# EAGLE design MI0283QT_v12 (EAGLE 6.6.0)
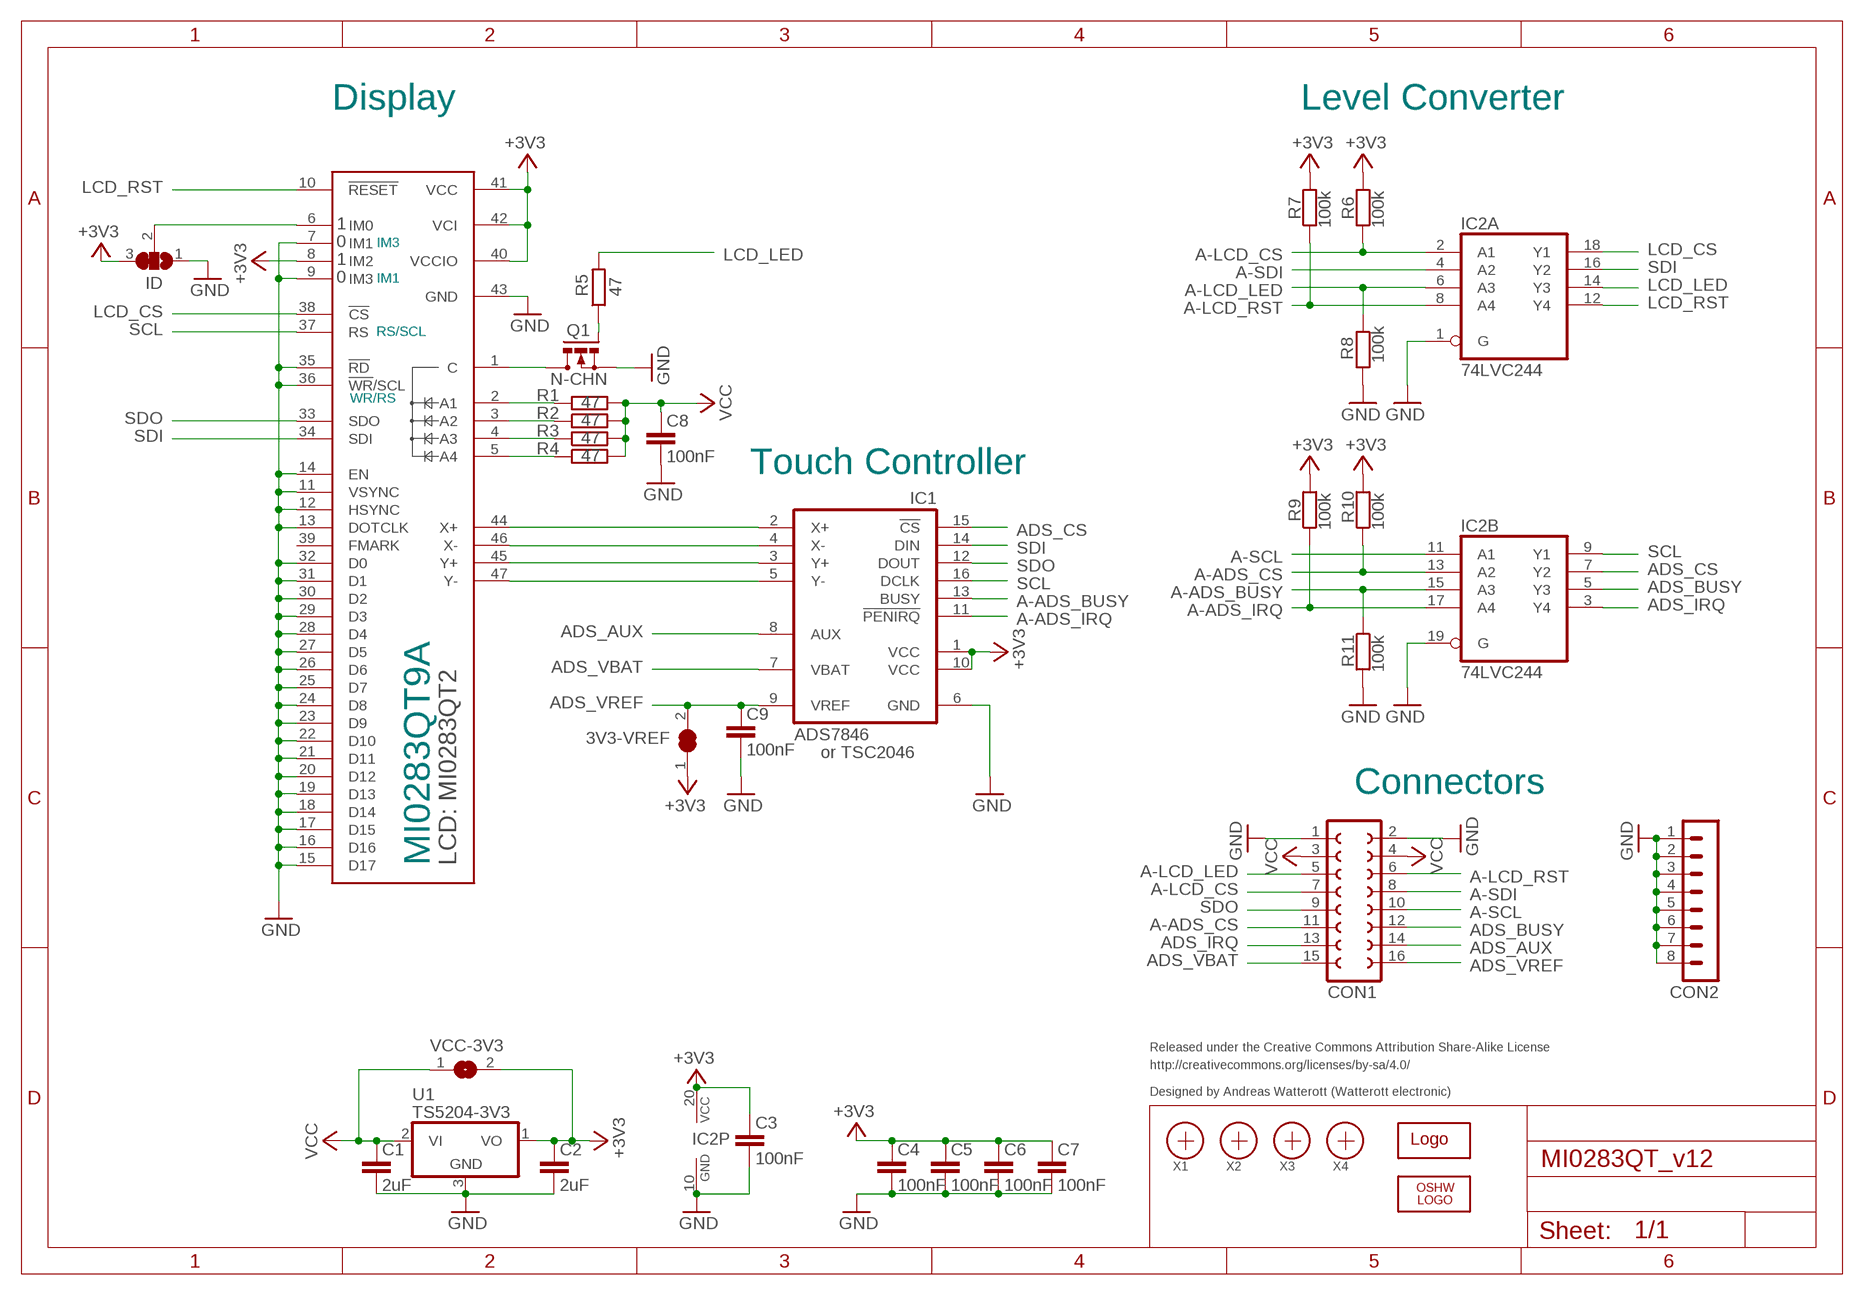
[diagram p0: schematic, sheet 1]

## Parts
3V3-VREF  SJ  [SJ]
C1  2uF  C-EUC0805  [C0805]
C2  2uF  C-EUC0805  [C0805]
C3  100nF  C-EUC0603  [C0603]
C4  100nF  C-EUC0603  [C0603]
C5  100nF  C-EUC0603  [C0603]
C6  100nF  C-EUC0603  [C0603]
C7  100nF  C-EUC0603  [C0603]
C8  100nF  C-EUC0603  [C0603]
C9  100nF  C-EUC0603  [C0603]
CON1  FE08-2  [FE08-2]
CON2  MA08-1  [MA08-1]
IC1  ADS7846  [SSOP16]
IC2  74LVC244  74HC244DW  [SO20W]
ID  SJ2W  [SJ_2]
LCD  MI0283QT  [MI0283QT]
LOGO1  OSHW_LOGO_6MILX0150-NT  [OSHW_6X150_NOTEXT]
Q1  N-CHN  IRLML2502  [MICRO3]
R1  47  R-EU_R0603  [R0603]
R2  47  R-EU_R0603  [R0603]
R3  47  R-EU_R0603  [R0603]
R4  47  R-EU_R0603  [R0603]
R5  47  R-EU_R0603  [R0603]
R6  100k  R-EU_R0603  [R0603]
R7  100k  R-EU_R0603  [R0603]
R8  100k  R-EU_R0603  [R0603]
R9  100k  R-EU_R0603  [R0603]
R10  100k  R-EU_R0603  [R0603]
R11  100k  R-EU_R0603  [R0603]
U1  TS5204-3V3  TS5204  [SOT23]
U$1  WE-LOGO  [WE-LOGO]
VCC-3V3  SJ  [SJ]
X1  PASSER  [PASSER]
X2  PASSER  [PASSER]
X3  PASSER  [PASSER]
X4  PASSER  [PASSER]

## Nets
+3V3: 3V3-VREF.1 C2.1 C3.1 C4.1 C5.1 C6.1 C7.1 IC1.1(VCC) IC1.10(VCC) IC2.20(P:VCC) ID.3 LCD.8(IM2) LCD.40(VCCIO) LCD.41(VCC) LCD.42(VCI) R6.2 R7.2 R9.2 R10.2 U1.1(VO) VCC-3V3.2
A-ADS_BUSY: IC1.13(BUSY) IC2.15(B:A3) R11.1
A-ADS_CS: CON1.11 IC2.13(B:A2) R10.1
A-ADS_IRQ: IC1.11(!PENIRQ) IC2.17(B:A4) R9.1
A-LCD_CS: CON1.7 IC2.2(A:A1) R6.1
A-LCD_LED: CON1.5 IC2.6(A:A3) R8.1
A-LCD_RST: CON1.6 IC2.8(A:A4) R7.1
A-SCL: CON1.10 IC2.11(B:A1)
A-SDI: CON1.8 IC2.4(A:A2)
ADS_AUX: CON1.14 IC1.8(AUX)
ADS_BUSY: CON1.12 IC2.5(B:Y3)
ADS_CS: IC1.15(!CS) IC2.7(B:Y2)
ADS_IRQ: CON1.13 IC2.3(B:Y4)
ADS_VBAT: CON1.15 IC1.7(VBAT)
ADS_VREF: 3V3-VREF.2 C9.1 CON1.16 IC1.9(VREF)
C: LCD.1(C) Q1.3(D)
GND: C1.2 C2.2 C3.2 C4.2 C5.2 C6.2 C7.2 C8.2 C9.2 CON1.1 CON1.2 CON2.1 CON2.2 CON2.3 CON2.4 CON2.5 CON2.6 CON2.7 CON2.8 IC1.6(GND) IC2.1(A:G) IC2.10(P:GND) IC2.19(B:G) ID.1 LCD.7(IM1) LCD.9(IM3) LCD.11(VSYNC) LCD.12(HSYNC) LCD.13(DOTCLK) LCD.14(EN) LCD.15(D17) LCD.16(D16) LCD.17(D15) LCD.18(D14) LCD.19(D13) LCD.20(D12) LCD.21(D11) LCD.22(D10) LCD.23(D9) LCD.24(D8) LCD.25(D7) LCD.26(D6) LCD.27(D5) LCD.28(D4) LCD.29(D3) LCD.30(D2) LCD.31(D1) LCD.32(D0) LCD.35(!RD) LCD.36(!WR!/SCL) LCD.43(GND) Q1.2(S) R8.2 R11.2 U1.3(GND)
IM0: ID.2 LCD.6(IM0)
LCD_CS: IC2.18(A:Y1) LCD.38(!CS)
LCD_LED: IC2.14(A:Y3) R5.2
LCD_RST: IC2.12(A:Y4) LCD.10(!RESET)
LED_A1: LCD.2(A1) R1.1
LED_A2: LCD.3(A2) R2.1
LED_A3: LCD.4(A3) R3.1
LED_A4: LCD.5(A4) R4.1
LEDPWM: Q1.1(G) R5.1
SCL: IC1.16(DCLK) IC2.9(B:Y1) LCD.37(RS)
SDI: IC1.14(DIN) IC2.16(A:Y2) LCD.34(SDI)
SDO: CON1.9 IC1.12(DOUT) LCD.33(SDO)
VCC: C1.1 C8.1 CON1.3 CON1.4 R1.2 R2.2 R3.2 R4.2 U1.2(VI) VCC-3V3.1
X+: IC1.2(X+) LCD.44(X+)
X-: IC1.4(X-) LCD.46(X-)
Y+: IC1.3(Y+) LCD.45(Y+)
Y-: IC1.5(Y-) LCD.47(Y-)
Unconnected: LCD.39(FMARK)

## Notes on the sheet
- Display | Level Converter
- 1
- 0 | IM3
- 1
- 0 | IM1
- RS/SCL
- WR/RS
- Touch Controller
- or TSC2046
- Connectors
- MI0283QT9A
- Released under the Creative Commons Attribution Share-Alike License
- http://creativecommons.org/licenses/by-sa/4.0/
- Designed by Andreas Watterott (Watterott electronic)

## Library data of the parts
3V3-VREF VCC-3V3 = jumper:SJ: SMD solder JUMPER
C1-C9 = rcl:C-EU: CAPACITOR, European symbol
CON1 = con-lsta:FE08-2: FEMALE HEADER
CON2 = con-lstb:MA08-1: PIN HEADER; OC_FARNELL: unknown; OC_NEWARK: unknown
IC1 = Display:ADS7846: ADS7846 Touch Screen Controller
IC2 = 74xx-eu:74*244: Octal BUFFER and LINE DRIVER, 3-state
ID = jumper:SJ2W: SMD solder JUMPER
LCD = Display:MI0283QT: Multi-Inno MIO283QT2 LCD (240x320) with Renesas R61505U controller
LOGO1 = OSHW:OSHW_LOGO_6MIL
Q1 = IRF-sot23:IRLML2502: N-Channel Power MOSFET
R1-R11 = rcl:R-EU_: RESISTOR, European symbol
U1 = Voltage-Reg:TS5204
U$1 = welectronic:WE-LOGO
X1-X4 = SMD:PASSER

## Board
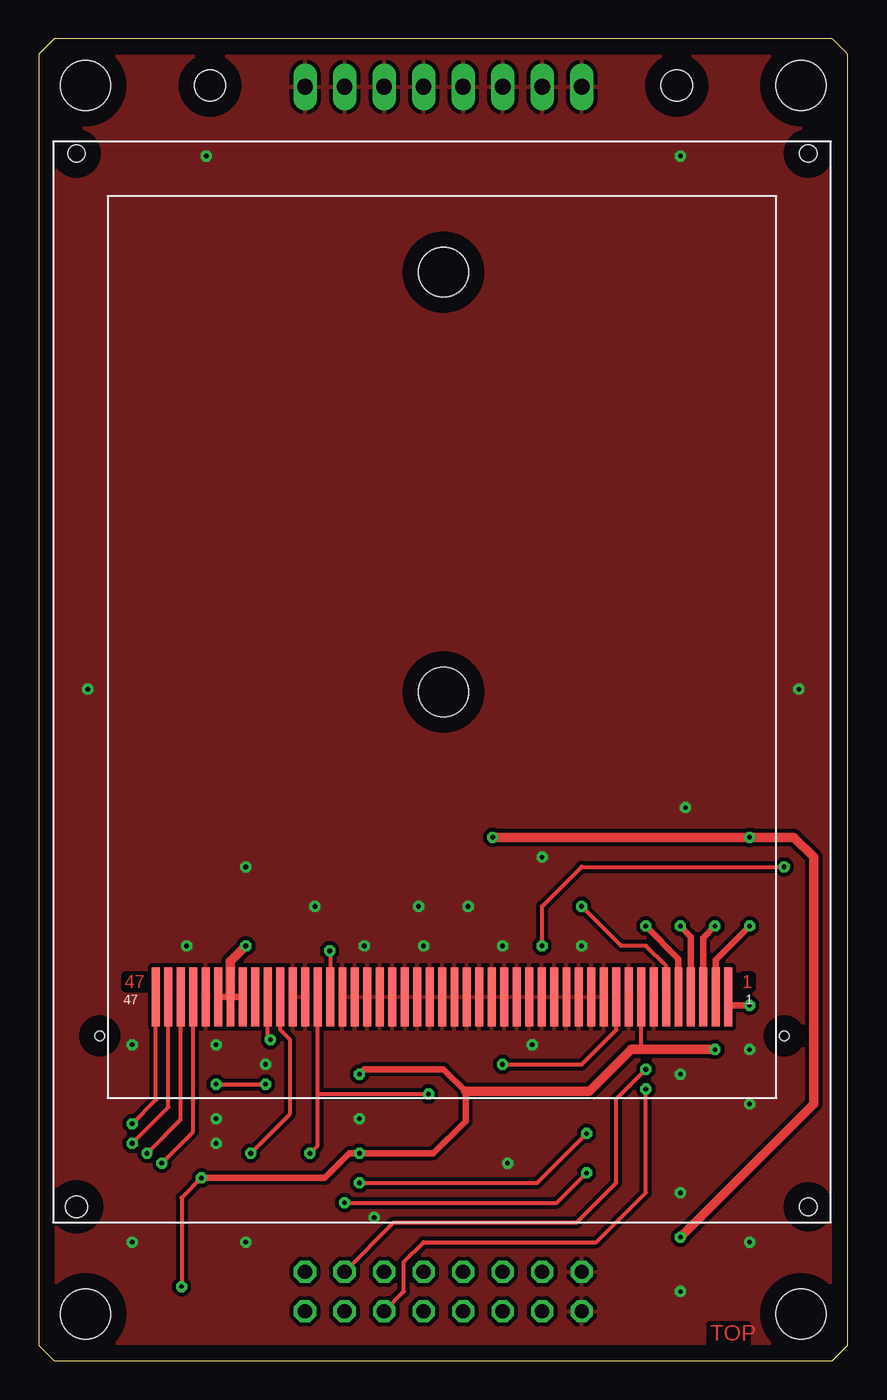
[diagram p1: board, top side]
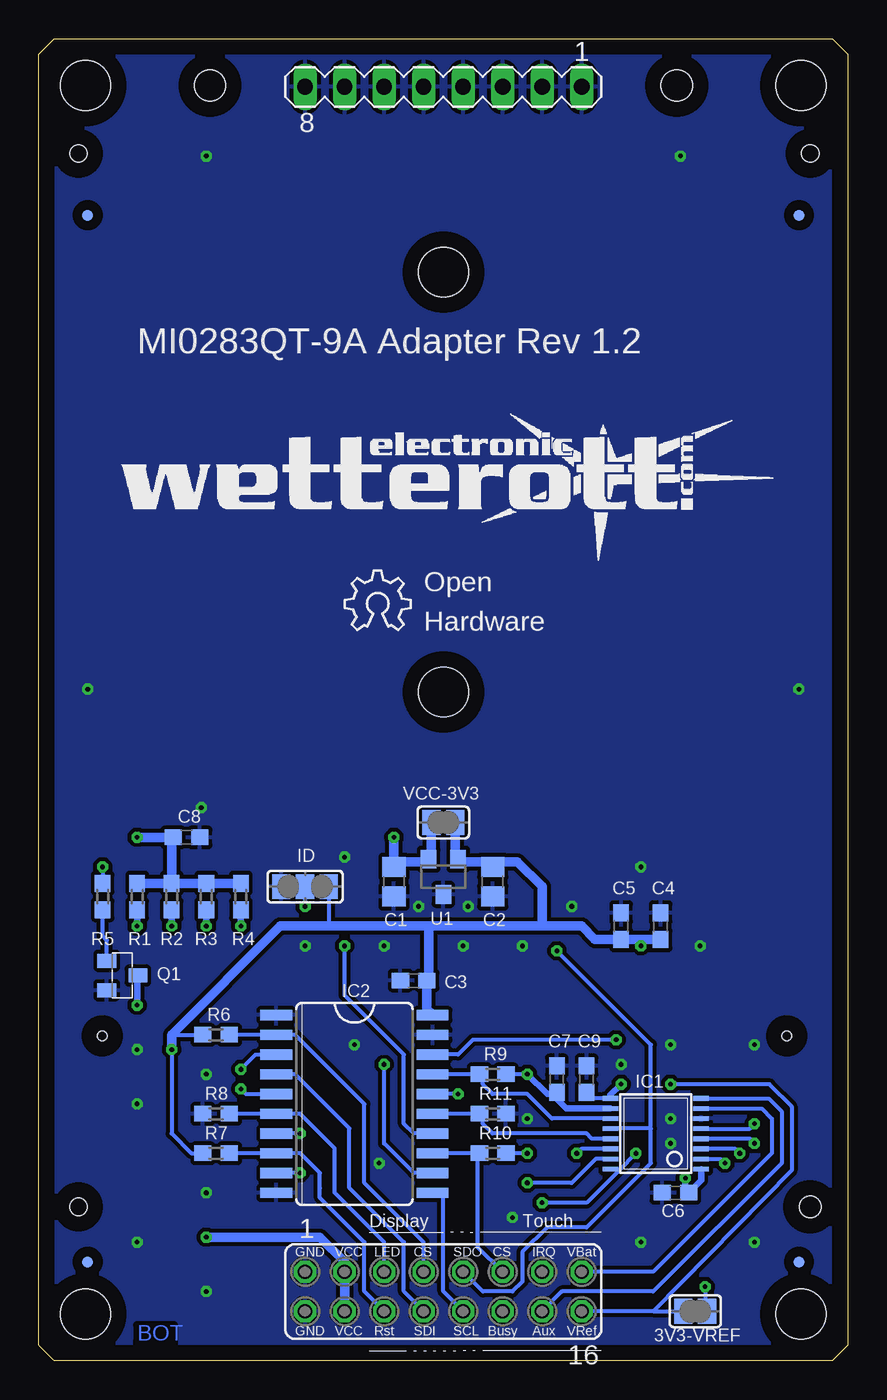
[diagram p2: board, bottom side, seen from below]

Size 52 x 85 mm. Coordinates in mm from the lower left corner, seen from the top.
Outline: 0,1 1,0 51,0 52,1 52,84 51,85 1,85 0,84 0,1
Copper layers (1*16): Top 0.035mm / dielectric 1.5mm / Bottom 0.035mm
Design rules "default *": minimum track width 10mil, minimum drill 0.3mm, track to track 8mil, track to pad 8mil, pad to pad 8mil, via to via 8mil, smd to smd 8mil, copper to edge 40mil, drill to drill 8mil, minimum pad ring 10mil, minimum via ring 8mil, stop-mask expansion 4mil, vias tented up to drill 0.5mm, thermal gap 10mil
Holes 3.2 mm at 3,3 49,3 3,82 49,82 26,43 26,70
Holes 2 mm at 41,82 11,82

### Footprints (pad centres in the part's own frame; a part is rotated, then mirrored left to right if it is on the bottom)
SJ = smd 1.168 x 1.6: 1 -0.762,0; 2 0.762,0
C0805 = smd 1.3 x 1.5: 1 -0.95,0; 2 0.95,0
C0603 = smd 1.1 x 1: 1 -0.85,0; 2 0.85,0
FE08-2 = drill 0.914 octagon: 1 -8.89,1.27; 2 -8.89,-1.27; 3 -6.35,1.27; 4 -6.35,-1.27; 5 -3.81,1.27; 6 -3.81,-1.27; 7 -1.27,1.27; 8 -1.27,-1.27; 9 1.27,1.27; 10 1.27,-1.27; 11 3.81,1.27; 12 3.81,-1.27; 13 6.35,1.27; 14 6.35,-1.27; 15 8.89,1.27; 16 8.89,-1.27
MA08-1 = drill 1.016 long: 1 -8.89,0; 2 -6.35,0; 3 -3.81,0; 4 -1.27,0; 5 1.27,0; 6 3.81,0; 7 6.35,0; 8 8.89,0
SSOP16 = smd 0.305 x 0.991: 1 -2.925,-2.918; 2 -2.275,-2.918; 3 -1.625,-2.918; 4 -0.975,-2.918; 5 -0.325,-2.918; 6 0.325,-2.918; 7 0.975,-2.918; 8 1.625,-2.918; 9 1.625,2.918; 10 0.975,2.918; 11 0.325,2.918; 12 -0.325,2.918; 13 -0.975,2.918; 14 -1.625,2.918; 15 -2.275,2.918; 16 -2.925,2.918
SO20W = smd 0.66 x 2.032: 1 -5.715,-5.029; 2 -4.445,-5.029; 3 -3.175,-5.029; 4 -1.905,-5.029; 5 -0.635,-5.029; 6 0.635,-5.029; 7 1.905,-5.029; 8 3.175,-5.029; 9 4.445,-5.029; 10 5.715,-5.029; 11 5.715,5.029; 12 4.445,5.029; 13 3.175,5.029; 14 1.905,5.029; 15 0.635,5.029; 16 -0.635,5.029; 17 -1.905,5.029; 18 -3.175,5.029; 19 -4.445,5.029; 20 -5.715,5.029
SJ_2 = smd 1.168 x 1.6: 1 -1.524,0; 2 0,0; 3 1.524,0
MI0283QT = smd 0.508 x 3.81: 1 43.4,14.5; 2 42.6,14.5; 3 41.8,14.5; 4 41,14.5; 5 40.2,14.5; 6 39.4,14.5; 7 38.6,14.5; 8 37.8,14.5; 9 37,14.5; 10 36.2,14.5; 11 35.4,14.5; 12 34.6,14.5; 13 33.8,14.5; 14 33,14.5; 15 32.2,14.5; 16 31.4,14.5; 17 30.6,14.5; 18 29.8,14.5; 19 29,14.5; 20 28.2,14.5; 21 27.4,14.5; 22 26.6,14.5; 23 25.8,14.5; 24 25,14.5; 25 24.2,14.5; 26 23.4,14.5; 27 22.6,14.5; 28 21.8,14.5; 29 21,14.5; 30 20.2,14.5; 31 19.4,14.5; 32 18.6,14.5; 33 17.8,14.5; 34 17,14.5; 35 16.2,14.5; 36 15.4,14.5; 37 14.6,14.5; 38 13.8,14.5; 39 13,14.5; 40 12.2,14.5; 41 11.4,14.5; 42 10.6,14.5; 43 9.8,14.5; 44 9,14.5; 45 8.2,14.5; 46 7.4,14.5; 47 6.6,14.5 | hole 1.1: 48.54,1; 48.54,68.75; 1.5,68.75 | hole 1.4: 1.5,1 | hole 0.6: 47,12; 3,12
MICRO3 = smd 0.9 x 1.2: 1 -0.95,-1; 2 0.95,-1; 3 0,1
R0603 = smd 1.1 x 1: 1 -0.85,0; 2 0.85,0
SOT23 = smd 1 x 1.2: 1 -0.95,-1.132; 2 0.95,-1.132; 3 0,1.132
PASSER = smd 0.7 x 0.7: X 0,0

### Placement (x,y rotation side)
3V3-VREF  9.81,3.17 180 bottom
C1  29.18,30.8 270 bottom
C2  22.82,30.8 270 bottom
C3  27.91,24.45 180 bottom
C4  12.03,27.94 90 bottom
C5  14.57,27.94 90 bottom
C6  11.08,10.79 180 bottom
C7  18.7,18.1 90 bottom
C8  42.51,33.66 0 bottom
C9  16.79,18.1 90 bottom
CON1  26,4.45 0 bottom
CON2  26,81.92 180 bottom
IC1  12.35,15.24 90 bottom
IC2  31.71,16.51 270 bottom
ID  34.89,30.48 0 bottom
LCD  0.92,8.89 0 top
LOGO1  32.35,46.99 0 bottom
Q1  46.64,24.77 270 bottom
R1  45.69,29.84 90 bottom
R2  43.46,29.84 90 bottom
R3  41.24,29.84 90 bottom
R4  39.02,29.84 90 bottom
R5  47.91,29.84 90 bottom
R6  40.61,20.95 180 bottom
R7  40.61,13.34 180 bottom
R8  40.61,15.88 180 bottom
R9  22.82,18.41 0 bottom
R10  22.82,13.34 0 bottom
R11  22.82,15.88 0 bottom
U1  26,31.11 180 bottom
U$1  46.95,51.12 0 bottom
VCC-3V3  26,34.61 0 bottom
X1  3.14,6.35 0 bottom
X2  3.14,73.66 0 bottom
X3  48.86,73.66 0 bottom
X4  48.86,6.35 0 bottom

### Tracks (layer width: path | path; a pad name or v marks a point on that pad's centre or on a via)
+3V3  (via drill 0.3)
  Top 0.254: LCD.8 38.72,20.02 38.7,20 | v10.44,11.75 9.17,10.48 v9.17,4.76 | 40.29,20 40.32,20
  Top 0.406: v20.6,18.41 20.92,18.73 26,18.73 27.43,17.3 27.43,15.4 25.36,13.34 v20.6,13.34 19.97,13.34 18.38,11.75 v10.44,11.75 | LCD.40 LCD.41 LCD.42
  Top 0.61: LCD.41 12.32,25.69 v13.3,26.67 | 27.43,17.3 35.37,17.3 38.06,20 38.7,20 40.29,20 v43.46,20
  Bottom 0.254: U1.1 25.24,32.44 | 18.8,17.14 C7.1 | v20.6,13.34 R10.2 | 26.95,24.45 C3.1 | 33.3,27.94 33.37,28 ID.3 | 10.44,11.01 C6.1 | 43.46,20.95 R6.2 | v20.6,18.41 R9.2 | v9.17,4.76 9.17,3.3 3V3-VREF.1 10.44,3.17 | v43.46,20 43.46,14.61 42.19,13.34 R7.2
  Bottom 0.406: IC1.10 18.09,16.21 18.7,16.83 C7.1 | v20.6,18.41 19.33,17.14 18.8,17.14 | IC1.1 9.43,11.59 C6.1 | v10.44,11.75 10.44,11.01
  Bottom 0.61: 25.24,32.44 VCC-3V3.2 | C3.1 27.05,22.59 IC2.20 | 26.95,27.94 26.95,24.45 | 26.95,27.94 33.3,27.94 36.48,27.94 43.46,20.95 v43.46,20 | 26.95,27.94 19.65,27.94 | 19.65,27.94 17.11,27.94 16.26,27.09 C5.1 13.3,27.09 | 13.3,27.09 C4.1 | 13.3,27.09 v13.3,26.67 | 22.5,32.07 C2.1 22.82,32.07 | 22.82,32.07 24.87,32.07 U1.1 | 22.82,32.07 21.24,32.07 19.65,30.48 19.65,27.94
A-ADS_BUSY
  Bottom 0.254: IC2.15 R11.1 23.46,15.66 23.46,15.24 22.82,14.61 16.79,14.61 16.45,14.27 IC1.13
A-ADS_CS
  Bottom 0.254: IC2.13 R10.1 23.78,13.23 23.78,7.3 CON1.11
A-ADS_IRQ
  Bottom 0.254: IC2.17 R9.1 23.46,18.2 23.46,17.78 22.82,17.14 20.6,17.14 19.02,15.56 IC1.11
A-LCD_CS
  Bottom 0.254: CON1.7 27.27,7.62 31.08,11.43 31.08,16.51 35.52,20.95 IC2.2 R6.1
A-LCD_LED
  Bottom 0.254: CON1.5 29.81,7.62 32.98,10.79 32.98,13.65 35.21,15.88 IC2.6 R8.1
A-LCD_RST
  Bottom 0.254: CON1.6 31.08,4.45 31.08,7.62 33.94,10.48 33.94,11.11 33.94,12.06 35.21,13.34 IC2.8 R7.1
A-SCL
  Bottom 0.254: CON1.10 26,4.45 26,10.79 IC2.11
A-SDI
  Bottom 0.254: CON1.8 28.54,4.45 28.54,7.62 32.03,11.11 32.03,14.92 35.52,18.41 IC2.4
ADS_AUX
  Bottom 0.254: IC1.8 5.08,16.86 4.25,16.03 4.25,12.7 12.51,4.45 18.38,4.45 CON1.14
ADS_BUSY  (via drill 0.3)
  Top 0.254: CON1.12 23.46,4.45 23.46,6.35 24.73,7.62 35.84,7.62 39.02,10.79 v39.02,17.46
  Bottom 0.254: v39.02,17.46 38.7,17.14 IC2.5
ADS_CS  (via drill 0.3)
  Top 0.254: v20.6,11.43 32.03,11.43 v35.21,14.61
  Bottom 0.254: IC1.15 16.21,12.96 17.74,11.43 v20.6,11.43 | v35.21,14.61 IC2.7
ADS_IRQ  (via drill 0.3)
  Top 0.254: v39.02,18.73 37.11,16.83 37.11,11.43 34.57,8.89 22.82,8.89 CON1.13
  Bottom 0.254: v39.02,18.73 38.06,19.68 IC2.3
ADS_VBAT
  Bottom 0.254: CON1.15 12.51,5.71 4.89,13.34 4.89,15.56 5.54,16.21 IC1.7
ADS_VREF  (via drill 0.3)
  Top 0.254: v11.39,17.78 v14.57,17.78
  Bottom 0.254: C9.1 16.41,16.86 IC1.9 15.27,17.09 | 12.51,3.17 CON1.16 | 12.51,3.17 3.62,12.22 3.62,16.35 5.05,17.78 v11.39,17.78 | 12.51,3.17 3V3-VREF.2
  Bottom 0.406: v14.57,17.78 15.27,17.09
C  (via drill 0.3)
  Top 0.254: 44.41,22.86 44.41,23.29 LCD.1
  Top 0.406: v45.69,22.86 44.41,22.86
  Bottom 0.254: Q1.3 45.69,24.77
  Bottom 0.406: 45.69,24.77 v45.69,22.86
GND  (via drill 0.3)
  other vias: 3.14,43.18 48.86,43.18 10.76,77.47 14.57,19.05 41.24,10.79 29.81,26.67 24.73,26.67 20.6,15.56 13.3,7.62 41.24,18.41 11.39,15.56 34.89,26.67 11.39,13.97 45.69,20 31.71,20.32 20.92,26.67 9.49,26.67 41.24,4.45 11.39,20.32 45.69,7.62 6,20.32 45.69,16.51 6,7.62 21.55,9.21 32.35,32.38 27.59,29.21 24.41,29.21 41.56,35.56 17.74,29.21 13.3,31.75 30.13,12.7 41.24,77.47
  pour Bottom (isolate 0.254): 0,85 52,85 52,0 0,0
  pour Top (isolate 0.254): 0,85 52,85 52,0 0,0
IM0  (via drill 0.3)
  Top 0.254: LCD.6 40.32,25.37 39.02,26.67 37.43,26.67 v34.89,29.21
  Bottom 0.254: v34.89,29.21 ID.2 33.3,30.48
LCD_CS  (via drill 0.3)
  Top 0.254: LCD.38 14.72,20.79 v14.89,20.64
  Bottom 0.254: IC2.18 25.05,19.68 24.09,20.64 v14.89,20.64
LCD_LED  (via drill 0.3)
  Top 0.254: v32.35,26.67 32.35,29.21 34.89,31.75 v47.91,31.75
  Bottom 0.254: IC2.14 27.91,14.61 28.54,15.24 28.54,19.68 32.35,23.5 v32.35,26.67 | v47.91,31.75 R5.2
LCD_RST  (via drill 0.3)
  Top 0.254: v29.81,19.05 34.89,19.05 37.12,21.28 LCD.10
  Bottom 0.254: IC2.12 27.91,12.06 29.81,13.97 v29.81,19.05
LED_A1  (via drill 0.3)
  Top 0.406: LCD.2 43.52,25.77 v45.69,27.94
  Bottom 0.254: 45.69,28.57 45.37,28.89 45.58,28.89 R1.1
  Bottom 0.406: v45.69,27.94 45.69,28.57
LED_A2  (via drill 0.3)
  Top 0.406: LCD.3 42.72,27.2 v43.46,27.94
  Bottom 0.406: v43.46,27.94 R2.1
LED_A3  (via drill 0.3)
  Top 0.406: LCD.4 41.92,27.26 v41.24,27.94
  Bottom 0.406: v41.24,27.94 R3.1
LED_A4  (via drill 0.3)
  Top 0.406: LCD.5 41.12,25.84 v39.02,27.94
  Bottom 0.406: v39.02,27.94 R4.1
LEDPWM
  Bottom 0.254: Q1.1 47.64,27.04 47.91,27.3 R5.1
SCL  (via drill 0.3)
  Top 0.254: v35.21,12.06 33.3,10.16 v19.65,10.16 | LCD.37 15.52,21.28 16.16,20.64 16.16,15.88 v13.62,13.34
  Bottom 0.254: v35.21,12.06 IC2.9 | IC1.16 14.64,12.31 | 14.64,12.31 v13.62,13.34 | v19.65,10.16 16.79,10.16 14.64,12.31
SDI  (via drill 0.3)
  Top 0.254: 17.92,17.14 17.92,13.82 v17.43,13.34 | 17.92,17.14 LCD.34 | 17.92,17.14 v25.05,17.14
  Bottom 0.254: v25.05,17.14 IC2.16 | IC1.14 17.15,13.62 v17.43,13.34
SDO  (via drill 0.3)
  Top 0.254: LCD.33 18.72,26.33 v18.7,26.35
  Bottom 0.254: CON1.9 23.46,4.45 21.55,4.45 20.92,5.08 20.92,6.99 19.33,8.57 16.79,8.57 12.66,12.7 12.66,14.92 | 12.66,14.92 15.26,14.92 IC1.12 | v18.7,26.35 12.66,20.32 12.66,14.92
VCC  (via drill 0.3)
  Top 0.61: v41.24,7.94 49.81,16.51 49.81,32.38 48.54,33.66 v45.69,33.66 v29.18,33.66
  Bottom 0.254: U1.2 26.76,32.44
  Bottom 0.61: 26.76,32.44 VCC-3V3.1 | R4.2 R3.2 R2.2 | R2.2 R1.2 | v41.24,7.94 33.94,7.94 32.35,6.35 CON1.3 CON1.4 | 43.46,33.66 C8.1 | v45.69,33.66 43.46,33.66 | 43.46,33.66 R2.2 | 26.95,32.07 U1.2 27.13,32.07 29.18,32.07 C1.1 v29.18,33.66
X+  (via drill 0.3)
  Top 0.254: LCD.44 9.92,14.71 v7.9,12.7
  Bottom 0.254: IC1.2 8.17,12.96 v7.9,12.7
X-  (via drill 0.3)
  Top 0.254: LCD.46 8.32,16.29 v6,13.97
  Bottom 0.254: IC1.4 6.29,14.27 v6,13.97
Y+  (via drill 0.3)
  Top 0.254: LCD.45 9.12,15.5 v6.95,13.34
  Bottom 0.254: IC1.3 7.23,13.62 v6.95,13.34
Y-  (via drill 0.3)
  Top 0.254: LCD.47 7.52,16.76 v6,15.24
  Bottom 0.254: IC1.5 6.31,14.91 v6,15.24

### Text on the board
Top: 47 | 1 | TOP
Bottom: BOT
bPlace: MI0283QT-9A Adapter Rev 1.2 | Open | Hardware | Touch | Display | VBat | IRQ | CS | SDO | CS | LED | VCC | GND | VRef | Aux | Busy | SCL | SDI | Rst | VCC | GND